# EAGLE design ldet_loop_preamp (EAGLE 7.4.0)
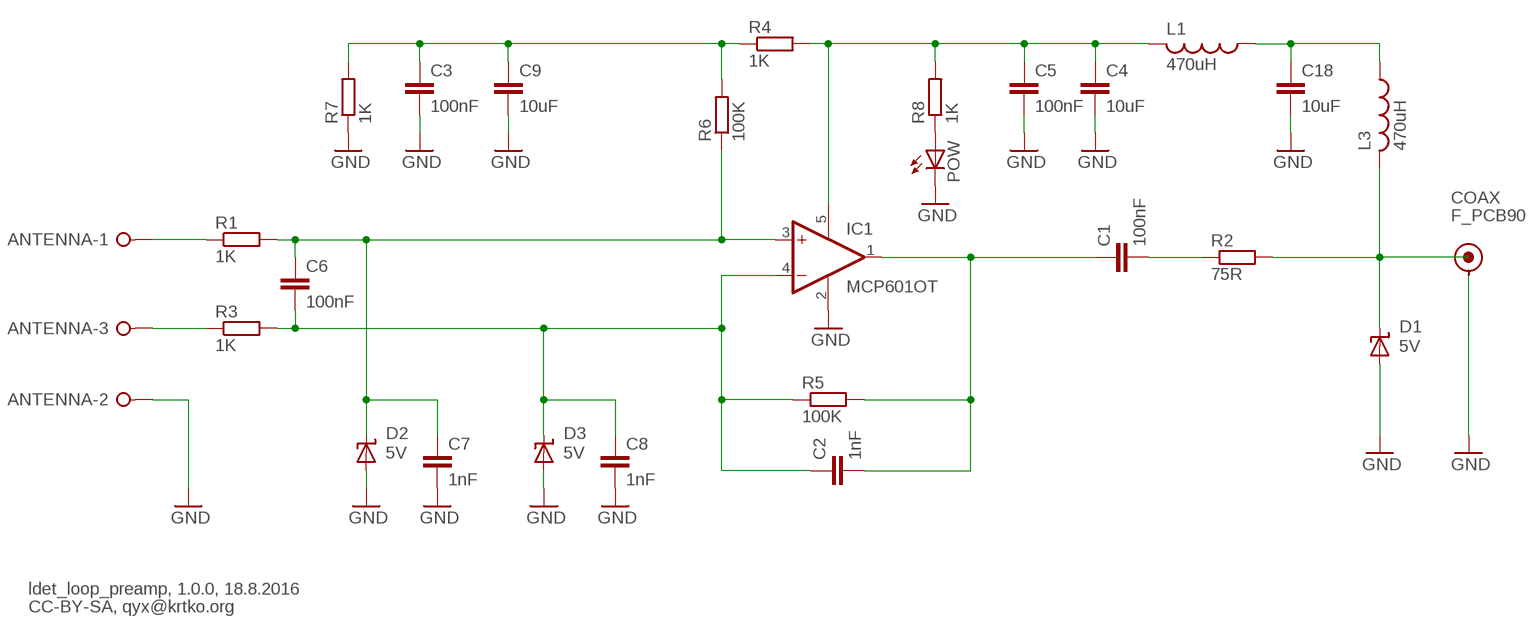
[diagram p0: schematic, sheet 1]

## Parts
ANTENNA  W237-3E  [W237-3E]
C1  100nF  C-EUC0603  [C0603]
C2  1nF  C-EUC0603  [C0603]
C3  100nF  C-EUC0603  [C0603]
C4  10uF  C-EUC1206  [C1206]
C5  100nF  C-EUC0603  [C0603]
C6  100nF  C-EUC0603  [C0603]
C7  1nF  C-EUC0603  [C0603]
C8  1nF  C-EUC0603  [C0603]
C9  10uF  C-EUC1206  [C1206]
C18  10uF  C-EUC1206  [C1206]
COAX  F_PCB90  [F_PCB_90]
D1  5V  SUPPRESSOR-SMBJ  [SMBJ]
D2  5V  SUPPRESSOR-SMBJ  [SMBJ]
D3  5V  SUPPRESSOR-SMBJ  [SMBJ]
IC1  MCP601OT  [SOT23-5]
L1  470uH  L-USL3225M  [L3225M]
L3  470uH  L-USL3225M  [L3225M]
POW  LEDCHIPLED_0603  [CHIPLED_0603]
R1  1K  R-EU_R0603  [R0603]
R2  75R  R-EU_R0603  [R0603]
R3  1K  R-EU_R0603  [R0603]
R4  1K  R-EU_R0603  [R0603]
R5  100K  R-EU_R0603  [R0603]
R6  100K  R-EU_R0603  [R0603]
R7  1K  R-EU_R0603  [R0603]
R8  1K  R-EU_R0603  [R0603]

## Nets
GND: ANTENNA.2 C3.2 C4.2 C5.2 C7.2 C8.2 C9.2 C18.2 COAX.S1(SHIELD) COAX.S2(SHIELD) COAX.S3(SHIELD) COAX.S4(SHIELD) D1.A D2.A D3.A IC1.2(V-) POW.C R7.1
N$1: COAX.C(CENTER) D1.C L3.2 R2.2
N$2: C1.2 R2.1
N$3: C18.1 L1.1 L3.1
N$4: C1.1 C2.2 IC1.1(OUT) R5.2
N$5: ANTENNA.3 R3.1
N$6: C4.1 C5.1 IC1.5(V+) L1.2 R4.2 R8.2
N$7: C3.1 C9.1 R4.1 R6.2 R7.2
N$8: POW.A R8.1
N$9: ANTENNA.1 R1.1
N$10: C2.1 C6.2 C8.1 D3.C IC1.4(-IN) R3.2 R5.1
N$11: C6.1 C7.1 D2.C IC1.3(+IN) R1.2 R6.1

## Notes on the sheet
- ldet_loop_preamp, 1.0.0, 18.8.2016
- CC-BY-SA, qyx@krtko.org

## Library data of the parts
ANTENNA = con-wago-508:W237-3E: WAGO SREW CLAMP; OC_FARNELL: unknown; OC_NEWARK: unknown
C1-C9 C18 = rcl:C-EU: CAPACITOR, European symbol
COAX = con-coax:F_PCB: Amphenol F coaxial connector, PCB right angle type
D1-D3 = diode:SUPPRESSOR-: Suppressor diode
IC1 = linear:MCP601: Single Op Amp 2.7V to 6.0V Single Supply CMOS Source: http://ww1.microchip.com/downloads/en/DeviceDoc/21314g.pdf
L1 L3 = rcl:L-US: INDUCTOR, American symbol; MPN: LQH32CN471K23L; OC_FARNELL: 9522255
POW = led:LED: LED OSRAM: - CHIPLED LG R971, LG N971, LY N971, LG Q971, LY Q971, LO R971, LY R971 LH N974, LH R974 LS Q976, LO Q976, LY Q976 LO Q996 - Hyper CHIPLED LW Q18S LB Q993, LB Q99A, LB R99A - SideLED LS A670, LO A670, LY A670, LG A670, LP A670 LB A673, LV A673, LT A673, LW A673 LH A674 LY A675 LS A676, LA A676, LO A676, LY A676, LW A676 LS A679, LY A679, LG A679 - Hyper Micro SIDELED® LS Y876, LA Y876, LO Y876, LY Y876 LT Y87S - SmartLED LW L88C, LW L88S LB L89C, LB L89S, LG L890 LS L89K, LO L89K, LY L89K LS L896, LA L896, LO L896, LY L896 - TOPLED LS T670, LO T670, LY T670, LG T670, LP T670 LSG T670, LSP T670, LSY T670, LOP T670, LYG T670 LG T671, LOG T671, LSG T671 LB T673, LV T673, LT T673, LW T673 LH T674 LS T676, LA T676, LO T676, LY T676, LB T676, LH T676, LSB T676, LW T676 LB T67C, LV T67C, LT T67C, LS T67K, LO T67K, LY T67K, LW E67C LS E67B, LA E67B, LO E67B, LY E67B, LB E67C, LV E67C, LT E67C LW T67C LS T679, LY T679, LG T679 LS T770, LO T770, LY T770, LG T770, LP T770 LB T773, LV T773, LT T773, LW T773 LH T774 LS E675, LA E675, LY E675, LS T675 LS T776, LA T776, LO T776, LY T776, LB T776 LHGB T686 LT T68C, LB T68C - Hyper Mini TOPLED® LB M676 - Mini TOPLED Santana® LG M470 LS M47K, LO M47K, LY M47K Source: http://www.osram.convergy.de LUXEON: - LUMILED® LXK2-PW12-R00, LXK2-PW12-S00, LXK2-PW14-U00, LXK2-PW14-V00 LXK2-PM12-R00, LXK2-PM12-S00, LXK2-PM14-U00 LXK2-PE12-Q00, LXK2-PE12-R00, LXK2-PE12-S00, LXK2-PE14-T00, LXK2-PE14-U00 LXK2-PB12-K00, LXK2-PB12-L00, LXK2-PB12-M00, LXK2-PB14-N00, LXK2-PB14-P00, LXK2-PB14-Q00 LXK2-PR12-L00, LXK2-PR12-M00, LXK2-PR14-Q00, LXK2-PR14-R00 LXK2-PD12-Q00, LXK2-PD12-R00, LXK2-PD12-S00 LXK2-PH12-R00, LXK2-PH12-S00 LXK2-PL12-P00, LXK2-PL12-Q00, LXK2-PL12-R00 Source: www.luxeon.com KINGBRIGHT: KA-3528ASYC Source: www.kingbright.com
R1-R8 = rcl:R-EU_: RESISTOR, European symbol

## Net classes
1 coplanar waveguide 75ohm: width 0.6 mm, clearance 0.35 mm

## Board
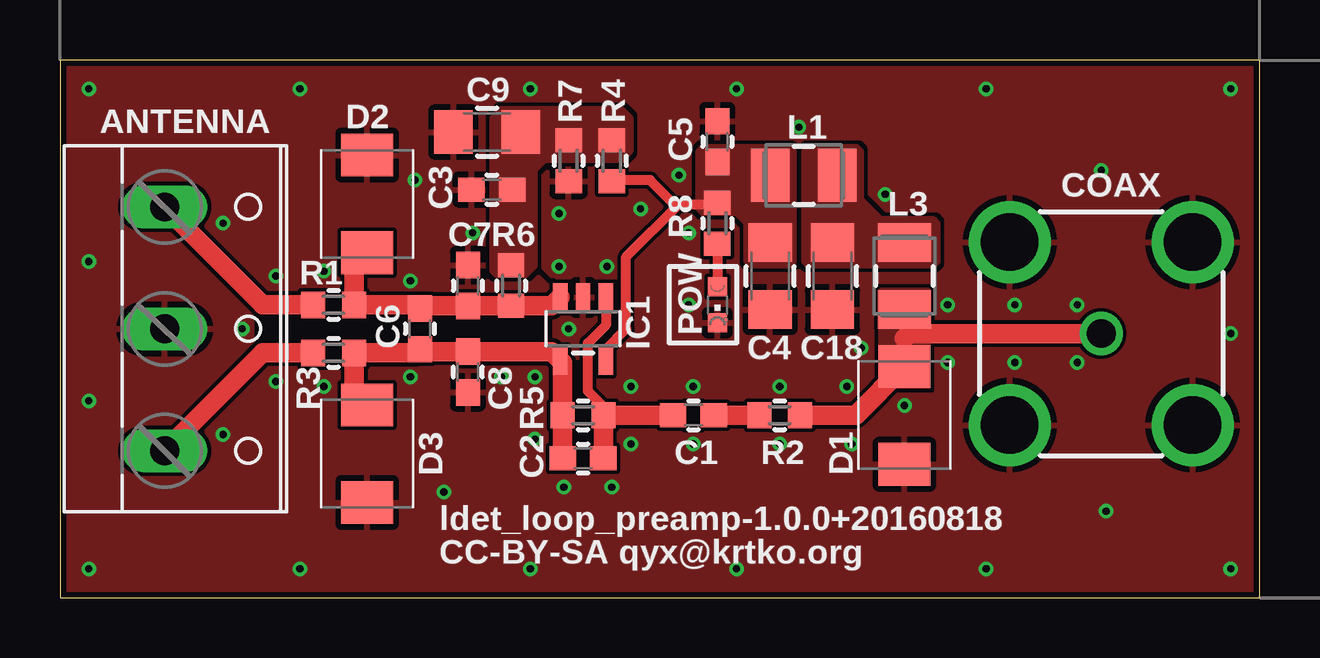
[diagram p1: board, top side]
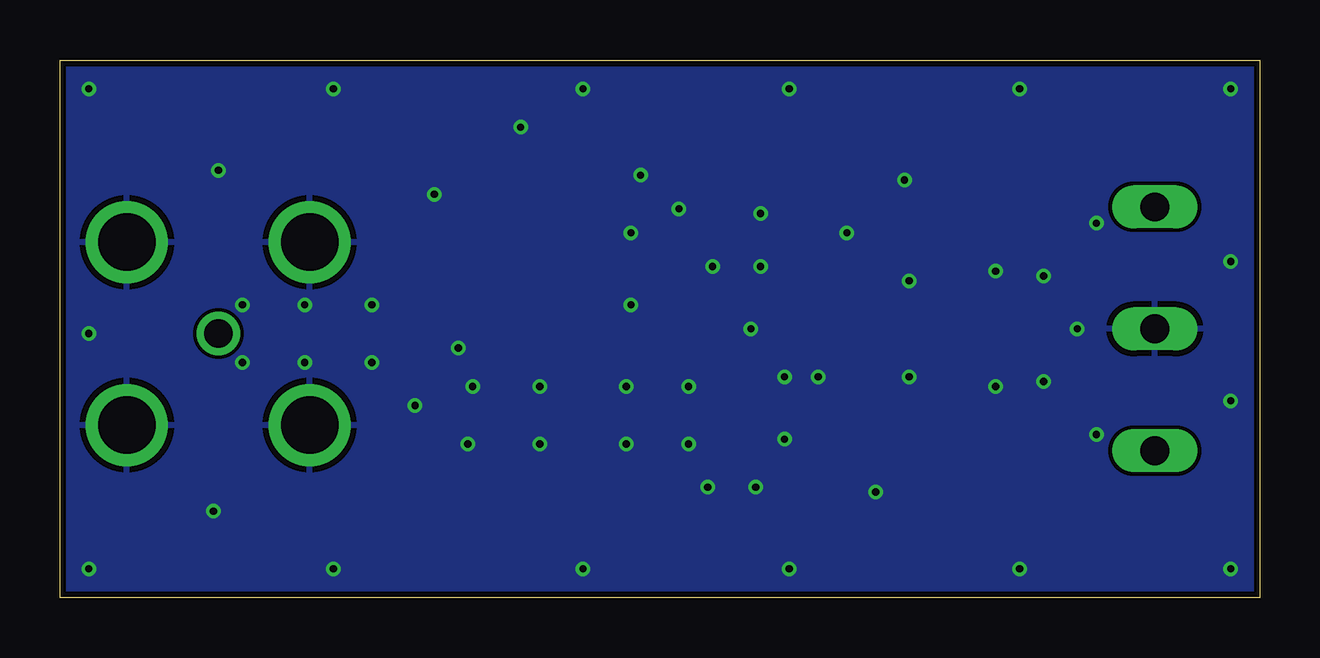
[diagram p2: board, bottom side, seen from below]

Size 50 x 22.4 mm. Coordinates in mm from the lower left corner, seen from the top.
Outline: 0,0 50,0 50,22.4 0,22.4 0,0
Copper layers (1*16): Top 0.035mm / dielectric 1.5mm / Bottom 0.035mm
Design rules "seeed": minimum track width 6mil, minimum drill 0.3mm, track to track 6mil, track to pad 6mil, pad to pad 6mil, via to via 6mil, smd to smd 0mil, copper to edge 10mil, drill to drill 10mil, minimum pad ring 6mil, minimum via ring 6mil, stop-mask expansion 2mil, vias tented up to drill 0.5mm, thermal gap 10mil
tRestrict: 12 lines

### Footprints (pad centres in the part's own frame; a part is rotated, then mirrored left to right if it is on the bottom)
W237-3E = drill 1.194 long: 1 -5.08,-0.635; 2 0,-0.635; 3 5.08,-0.635
C0603 = smd 1.1 x 1: 1 -0.85,0; 2 0.85,0
C1206 = smd 1.6 x 1.8: 1 -1.4,0; 2 1.4,0
F_PCB_90 = drill 1.2: C 0,0 | drill 2.4: S1 -3.81,-3.81; S2 3.81,-3.81; S3 3.81,3.81; S4 -3.81,3.81
SMBJ = smd 1.78 x 2.16: A 2.04,0; C -2.03,0
SOT23-5 = smd 0.6 x 1.2: 1 -0.95,-1.306; 2 0,-1.306; 3 0.95,-1.306; 4 0.95,1.306; 5 -0.95,1.306
L3225M = smd 1.6 x 2.2: 1 -1.4,0; 2 1.4,0
CHIPLED_0603 = smd 0.8 x 0.8: A 0,-0.75; C 0,0.75
R0603 = smd 1 x 1.1: 1 -0.85,0; 2 0.85,0

### Placement (x,y rotation side)
ANTENNA  5,11.2 270 top
C1  26.4,7.6 0 top
C2  21.8,5.8 0 top
C3  18,17 180 top
C4  29.6,13.4 270 top
C5  27.4,19 90 top
C6  15,11.2 270 top
C7  17,13 90 top
C8  17,9.4 270 top
C9  17.8,19.4 180 top
C18  32.2,13.4 270 top
COAX  43.4,11 0 top
D1  35.2,7.6 270 top
D2  12.8,16.4 90 top
D3  12.8,6 270 top
IC1  21.8,11.2 180 top
L1  31,17.6 180 top
L3  35.2,13.4 270 top
POW  27.4,12.2 180 top
R1  11.4,12.2 0 top
R2  30,7.6 0 top
R3  11.4,10.2 0 top
R4  23,18.2 270 top
R5  21.8,7.6 0 top
R6  18.8,13 90 top
R7  21.2,18.2 90 top
R8  27.4,15.6 90 top

### Tracks (layer width: path | path; a pad name or v marks a point on that pad's centre or on a via)
GND  (via drill 0.3)
  other vias: 1.2,1.2 10,1.2 19.6,1.2 28.2,1.2 38.6,1.2 48.8,1.2 48.8,11 48.8,21.2 38.6,21.2 28.2,21.2 19.6,21.2 10,21.2 1.2,21.2 1.2,14 1.2,8.2 7.6,11.2 6.8,6.8 9,9 9,13.4 6.8,15.6 11,13.6 11,8.8 14.6,13.2 14.6,9.2 17.2,15.2 21.2,11.2 22.8,13.8 20.8,13.8 18.4,9.2 19.8,9.2 19.8,6.6 23.8,6.4 23,4.6 21,4.6 26.4,6.4 26.4,8.8 23.8,8.8 30,8.8 30,6.4 32.8,8.8 33.4,10.4 35.2,8 37,9.8 37,12.2 33,6.4 39.8,12.2 42.4,12.2 42.4,9.8 39.8,9.8 34.4,16.8 30.8,19.6 26.2,15.2 24.2,16.2 20.8,16 25.8,17.6 14.8,17.4 16,4.4 43.6,3.6 43.4,17.8 26.2,12.2
  pour Top (rank 2): 0,0 50,0 50,22.4 0,22.4
  pour Bottom (rank 2): 0,0 50,0 50,22.4 0,22.4
N$1
  Top 0.813: R2.2 33.17,7.6 D1.C | COAX.C 35.4,11 35.2,10.8
  pour Top (no thermals): 34.2,8.8 36.2,8.8 36.2,12.8 34.2,12.8
N$2
  Top 0.813: R2.1 C1.2
N$3
  pour Top (no thermals): 31.6,18.8 33.2,18.8 33.4,18.6 33.4,16.6 34.2,15.8 36.4,15.8 36.6,15.6 36.6,14 36.4,13.8 31.2,13.8 31,14 31,18.6 31.2,18.8
N$4
  Top 0.406: R5.2 22.65,7.95 22,8.6 22,10.6 22.75,11.35 IC1.1
  Top 0.813: C1.1 R5.2 C2.2
N$5
  Top 0.813: R3.1 8.45,10.2 ANTENNA.3
N$6
  Top 0.406: IC1.5 22.75,10.35 23.6,11.2 23.6,14.2 25.8,16.4 | 25.8,16.4 27.35,16.4 R8.2 | 25.8,16.4 25.6,16.4 24.6,17.4 23.05,17.4 R4.2
  pour Top (no thermals): 26.8,18.8 30.4,18.8 30.6,18.6 30.6,14 30.4,13.8 28.8,13.8 28.6,14 28.6,15.6 28.2,16 26.8,16 26.6,16.2 26.6,18.6
N$7
  pour Top (no thermals): 18.4,20.4 23.4,20.4 23.8,20 23.8,18.6 23.6,18.4 23.4,18.2 20.2,18.2 19.8,17.8 19.8,13.8 19.4,13.4 18.2,13.4 18,13.6 18,20
N$8
  Top 0.406: R8.1 POW.A
N$9
  Top 0.813: R1.1 8.45,12.2 ANTENNA.1
N$10
  Top 0.813: D3.C 12.25,8.58 R3.2 14.85,10.2 C6.2 15.1,10.25 C8.1 20.49,10.25 IC1.4 20.95,9.79 R5.1 C2.1
N$11
  Top 0.813: D2.C 12.25,13.82 R1.2 14.85,12.2 C6.1 15.1,12.15 C7.1 R6.1 20.49,12.15 IC1.3

### Text on the board
tNames: ldet_loop_preamp-1.0.0+20160818 | CC-BY-SA qyx@krtko.org